# Altium project Motor Controller V2.PrjPcb
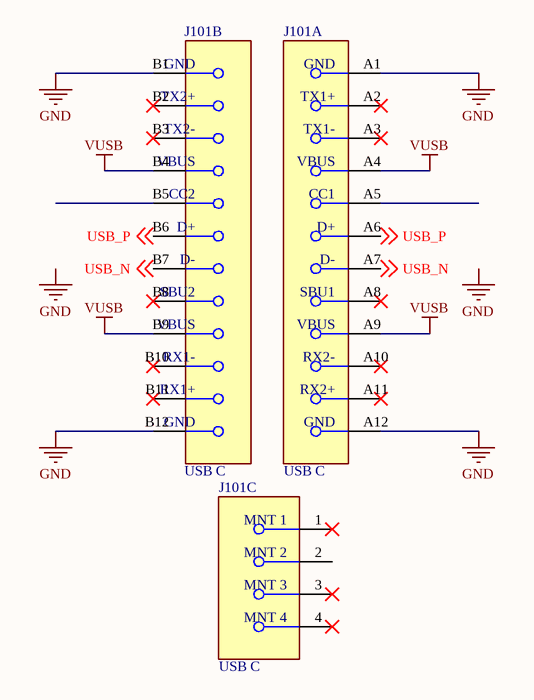
[diagram p0: Ports.SchDoc]
4 sheets, 44 parts. Net scope: global (net labels, ports and power ports of the same name join across sheets).
Board file: Main.PcbDoc
Sheets:
  Ports.SchDoc
  RP2040.SchDoc
  DRV8316.SchDoc
  AS5048A.SchDoc

## Sheet Ports.SchDoc
size A; SheetNumber: 1; SheetTotal: 3

### Parts
J101  USB C  [FP-1054500101-MFG]  (parts A,B,C of 3)

### Nets
GND: J101.A1(GND) J101.A12(GND) J101.B1(GND) J101.B12(GND)
VUSB: J101.A4(VBUS) J101.A9(VBUS) J101.B4(VBUS) J101.B9(VBUS)
USB_N: J101.A7(D-) J101.B7(D-) ; off-sheet USB_N
USB_P: J101.A6(D+) J101.B6(D+) ; off-sheet USB_P

Not connected (* = marked no-connect by the designer): J101 1(MNT_1)* 2(MNT_2) 3(MNT_3)* 4(MNT_4)* A2(TX1+)* A3(TX1-)* A5(CC1) A8(SBU1)* A10(RX2-)* A11(RX2+)* B2(TX2+)* B3(TX2-)* B5(CC2) B8(SBU2)* B10(RX1-)* B11(RX1+)*

### Notes on the sheet
- Labels drawn without touching a wire or pin: GND

### Library data of the parts
J101 = 1054500101: CONN RCP USB3.1 TYPEC 24P SMD RA; Manufacturer: Molex; Number Of Contacts: 24; Voltage Rating: 30V; Shielding: true; Is Female: yes; Current Rating: 0.25/1.25/5A; Pitch: 0.5mm; Conn Orientation: Right Angle; Package: 0; Height: 3.44mm; Footprint Url: https://www.molex.com/pdm_docs/sd/1054500101_sd.pdf; Device Class L1: Connectors; Category: Conn; Device Class L2: USB Connectors; Digikey Description: CONN RCP USB3.1 TYPEC 24P SMD RA; Contact Material: Gold,Nickel; Mouser Description: USB Shielded I/O Receptacle; Type C; Right Angle; Surface Mount; Gold over Nickel; ComponentLink2Description: Datasheet; Lead Free: Yes; Automotive: No; Temperature Range High: +85°C; RoHS: TRUE; Octopart: https://octopart.com/105450-0101-molex-68082325; ComponentLink2URL: https://www.molex.com/webdocs/datasheets/pdf/en-us/1054500101_IO_CONNECTORS.pdf; Temperature: -30°C to +85°C; Usb Standard: USB 3.1; Temperature Range Low: -30°C; Device Class L3: unset; Manufacturer Part Number: 1054500101; Supplier 1: Digi-Key; Supplier Part Number 1: WM12856CT-ND

## Sheet RP2040.SchDoc
size A3; SheetNumber: 2; SheetTotal: 4
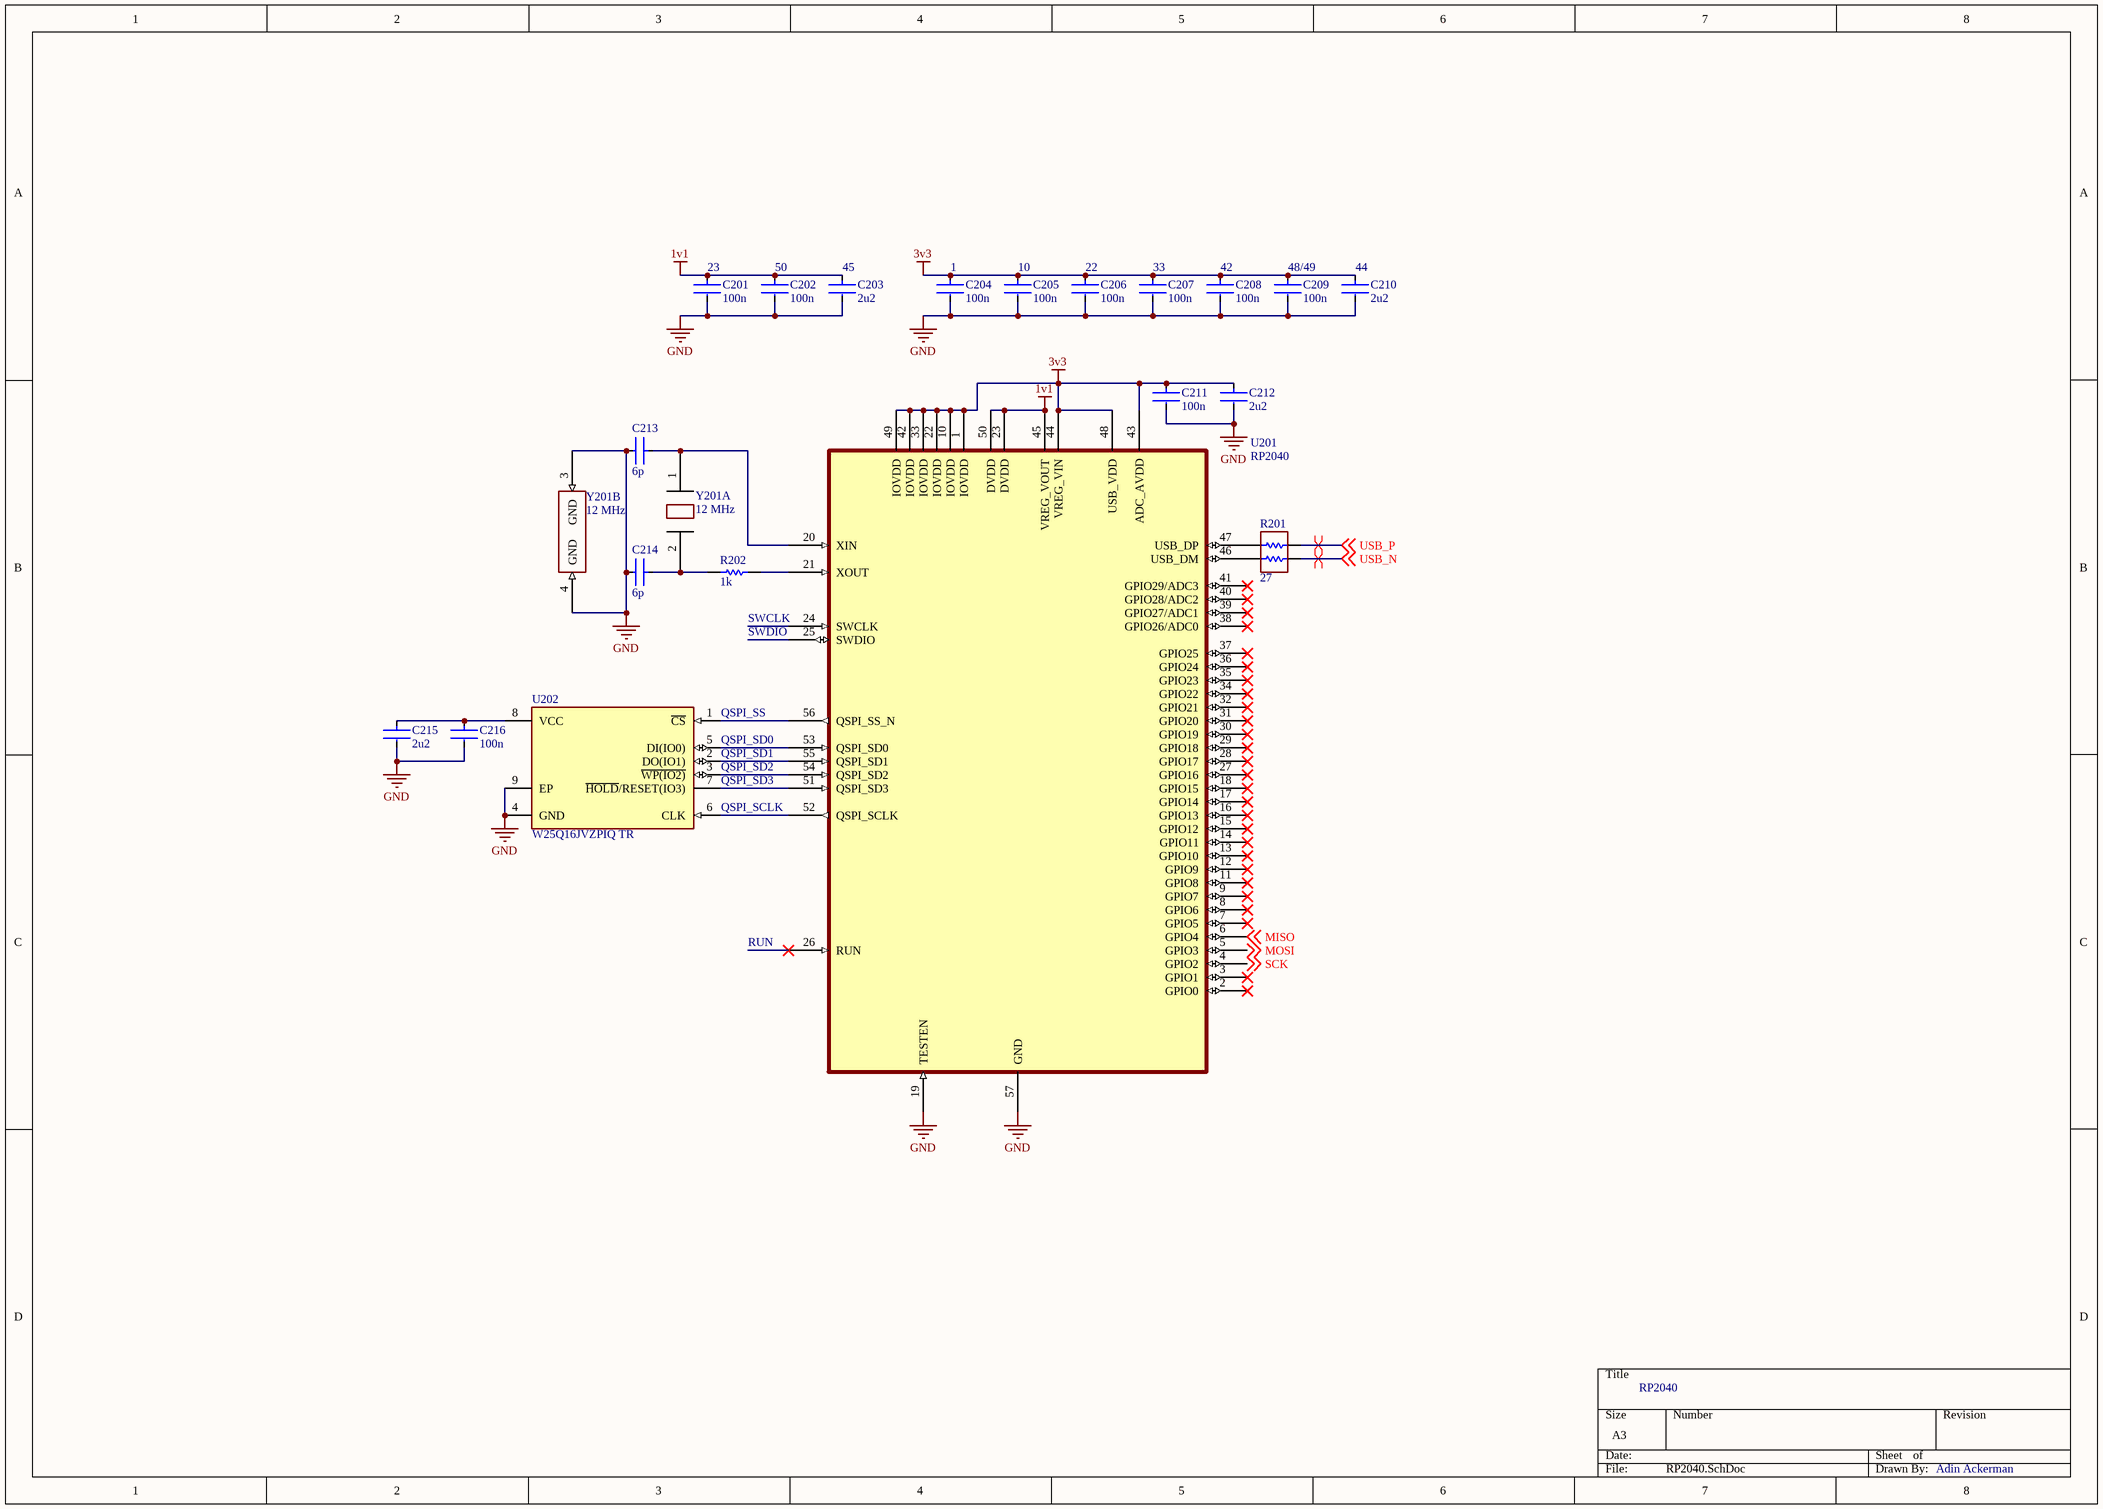
[diagram p1: RP2040.SchDoc]

### Parts
C201  100n  [FP-GCM155-0_05-MFG]
C202  100n  [FP-GCM155-0_05-MFG]
C203  2u2  [CAPC1608X10N]
C204  100n  [FP-GCM155-0_05-MFG]
C205  100n  [FP-GCM155-0_05-MFG]
C206  100n  [FP-GCM155-0_05-MFG]
C207  100n  [FP-GCM155-0_05-MFG]
C208  100n  [FP-GCM155-0_05-MFG]
C209  100n  [FP-GCM155-0_05-MFG]
C210  2u2  [CAPC1608X10N]
C211  100n  [FP-GCM155-0_05-MFG]
C212  2u2  [CAPC1608X10N]
C213  6p  [FP-GCQ155-0_05-MFG]
C214  6p  [FP-GCQ155-0_05-MFG]
C215  2u2  [CAPC1608X10N]
C216  100n  [FP-GCM155-0_05-MFG]
R201  27  [CAC-65P100X100-4L]
R202  1k  [RESC1005X04N]
U201  RP2040  [QFN40P700X700X90_HS-57N]
U202  W25Q16JVZPIQ TR  [WSON-8]
Y201  12 MHz  (parts A,B of 2)

### Nets
1v1: C201.1 C202.1 C203.1 U201.23(DVDD) U201.45(VREG_VOUT) U201.50(DVDD)
3v3: C204.1 C205.1 C206.1 C207.1 C208.1 C209.1 C210.1 C211.1 C212.1 U201.1(IOVDD) U201.10(IOVDD) U201.22(IOVDD) U201.33(IOVDD) U201.42(IOVDD) U201.43(ADC_AVDD) U201.44(VREG_VIN) U201.48(USB_VDD) U201.49(IOVDD)
GND: C201.2 C202.2 C203.2 C204.2 C205.2 C206.2 C207.2 C208.2 C209.2 C210.2 C211.2 C212.2 C213.2 C214.2 C215.2 C216.2 U201.19(TESTEN) U201.57(GND) U202.4(GND) U202.9(EP) Y201.3(GND) Y201.4(GND)
MISO: U201.6(GPIO4) ; off-sheet MISO
MOSI: U201.5(GPIO3) ; off-sheet MOSI
SCK: U201.4(GPIO2) ; off-sheet SCK
USB_N: R201.3 ; off-sheet USB_N
USB_P: R201.4 ; off-sheet USB_P
NetC213_1: C213.1 U201.20(XIN) Y201.1
NetC214_1: C214.1 R202.1 Y201.2
NetC215_1: C215.1 C216.1 U202.8(VCC)
NetR201_1: R201.1 U201.47(USB_DP)
NetR201_2: R201.2 U201.46(USB_DM)
NetR202_2: R202.2 U201.21(XOUT)
NetU201_51: U201.51(QSPI_SD3) U202.7(~{HOLD}/RESET(IO3))
NetU201_52: U201.52(QSPI_SCLK) U202.6(CLK)
NetU201_53: U201.53(QSPI_SD0) U202.5(DI(IO0))
NetU201_54: U201.54(QSPI_SD2) U202.3(~{WP(IO2)})
NetU201_55: U201.55(QSPI_SD1) U202.2(DO(IO1))
NetU201_56: U201.56(QSPI_SS_N) U202.1(~{CS})

Not connected (* = marked no-connect by the designer): U201 2(GPIO0)* 3(GPIO1)* 7(GPIO5)* 8(GPIO6)* 9(GPIO7)* 11(GPIO8)* 12(GPIO9)* 13(GPIO10)* 14(GPIO11)* 15(GPIO12)* 16(GPIO13)* 17(GPIO14)* 18(GPIO15)* 24(SWCLK) 25(SWDIO) 26(RUN)* 27(GPIO16)* 28(GPIO17)* 29(GPIO18)* 30(GPIO19)* 31(GPIO20)* 32(GPIO21)* 34(GPIO22)* 35(GPIO23)* 36(GPIO24)* 37(GPIO25)* 38(GPIO26/ADC0)* 39(GPIO27/ADC1)* 40(GPIO28/ADC2)* 41(GPIO29/ADC3)*

### Layout directives
differential pair: USB_N, USB_P

### Notes on the sheet
- (near C201) 23
- (near C202) 50
- (near C203) 45
- (near C204) 1
- (near C205) 10
- (near C206) 22
- (near C207) 33
- (near C208) 42
- (near C209) 48/49
- (near C210) 44
- SWCLK
- SWDIO
- (near U202) QSPI_SS
- (near U202) QSPI_SD0
- (near U202) QSPI_SD1
- (near U202) QSPI_SD2
- (near U202) QSPI_SD3
- (near U202) QSPI_SCLK
- RUN
- RP2040
- Adin Ackerman

### Library data of the parts
C201 C202 C204-C209 C211 C216 = GCM155R71H104KE02J: Ceramic Capacitor for Automotive 100nF ±10% 50VDC X7R 0402 Paper T/R; Voltage Rating (DC): 50V; Case Code (Metric): 1005; Dielectric: X7R; Capacitance: 100nF; Packaging: Tape and Reel; Min Operating Temperature: -55°C; Length: 0.039inch; Thickness: 0.022inch; Height: 0.5mm; Mount: Surface Mount; Termination: SMD/SMT; Voltage Rating: 50V; Package Quantity: 50000; Width: 0.02inch; Case/Package: 0402; Case Code (Imperial): 0402; Ratings: AEC-Q200; Max Operating Temperature: 125°C; Tolerance: 10%; Weight: 0.000212oz; Supplier 1: Digi-Key; Supplier Part Number 1: 490-14514-1-ND
C203 C210 C212 C215 = GRT188R61H225ME13D: Multilayer Ceramic Capacitors MLCC - SMD/SMT 0603 50Vdc 2.2uF X5R 20%; Supplier 1: Future Electronics; Supplier Part Number 1: 5087209
C213 C214 = GCQ1555C1H6R0BB01D: High Q Ceramic Capacitor for Automotive 6pF ±0.1pF 50VDC C0G 0402 Paper T/R; Voltage Rating: 50V; Max Operating Temperature: 125°C; Capacitance: 6pF; Case Code (Imperial): 0402; Min Operating Temperature: -55°C; Case/Package: 0402; Mount: Surface Mount; Case Code (Metric): 1005; Ratings: AEC-Q200; Packaging: Tape and Reel; Supplier 1: Digi-Key; Supplier Part Number 1: 490-17493-1-ND
R201 = EXB-24V270JX: Supplier 1: Digi-Key; Supplier Part Number 1: Y5270CT-ND
R202 = ERJ-2GEJ102X: Manufacturer: Panasonic; Part Number: ERJ-2GEJ102X; Supplier 1: Newark; Supplier Part Number 1: 65T8247
U202 = W25Q16JVZPIQ TR: IC FLASH 16M SPI 133MHZ 8WSON; Memory Type: Non-Volatile; Memory Size: 16Mb; Max Operating Temperature: 85°C; Min Operating Temperature: -40°C; Frequency: 133MHz; Mount: Surface Mount; Packaging: Tape and Reel; Supplier 1: Digi-Key; Supplier Part Number 1: W25Q16JVZPIQCT-ND
Y201 = ABM10-166-12.000MHZ-T3: Supplier 1: Newark; Supplier Part Number 1: 51AC8104
U201 = RP2040: Supplier 1: Newark; Supplier Part Number 1: 49AJ8739

## Sheet DRV8316.SchDoc
size A4; SheetNumber: 3; SheetTotal: 4
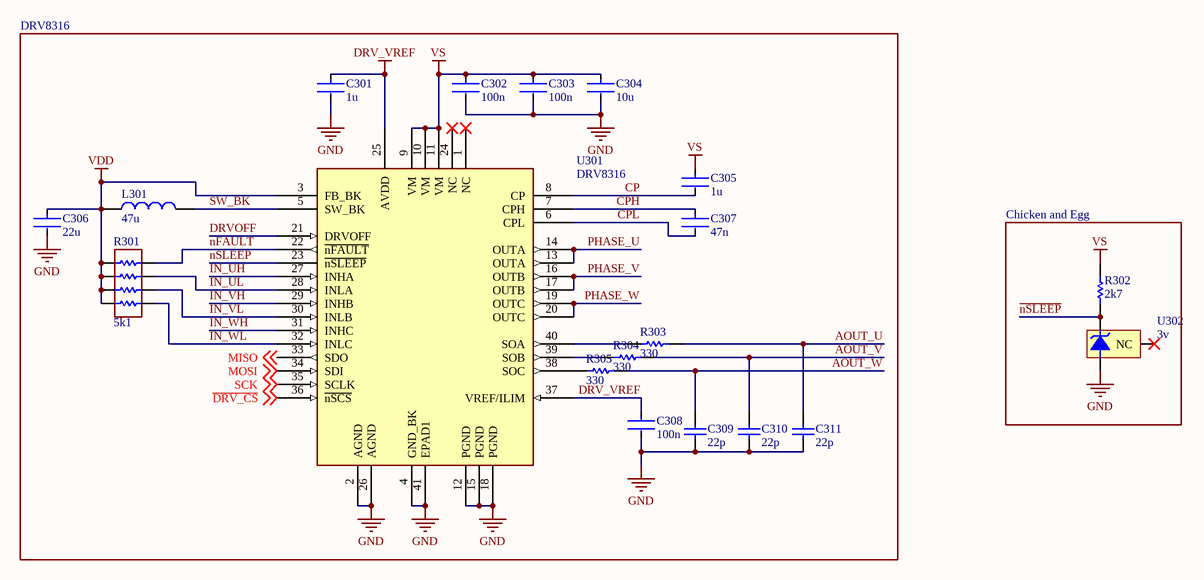
[diagram p2: DRV8316.SchDoc]

### Parts
C301  1u  [FP-GRM155-0_1-MFG]
C302  100n  [FP-GCM155-0_05-MFG]
C303  100n  [FP-GCM155-0_05-MFG]
C304  10u  [FP-GRT31C-0_2-IPC_C]
C305  1u  [FP-GRM155-0_1-MFG]
C306  22u  [FP-GRM188-0_2-IPC_C]
C307  47n  [FP-GRM155-0_05-MFG]
C308  100n  [FP-GCM155-0_05-MFG]
C309  22p  [CAPC1005X55X25LL05T10]
C310  22p  [CAPC1005X55X25LL05T10]
C311  22p  [CAPC1005X55X25LL05T10]
L301  47u  [INDC3225X25N]
R301  5k1  [CAC-50P200X100-8L]
R302  2k7  [RESC1005X04N]
R303  330  [RESC1005X04N]
R304  330  [RESC1005X04N]
R305  330  [RESC1005X04N]
U301  DRV8316  [QFN50P500X700X100_HS-41L]
U302  3v  [SOT95P237X112-3L]

### Blocks framed on the sheet
DRV8316: C301-C311 L301 R301 R303-R305 U301
Chicken and Egg: R302 U302

### Nets
DRV_VREF: C301.1 C308.1 U301.25(AVDD) U301.37(VREF/ILIM)
GND: C301.2 C302.2 C303.2 C304.2 C306.2 C308.2 C309.1 C310.1 C311.1 U301.2(AGND) U301.4(GND_BK) U301.12(PGND) U301.15(PGND) U301.18(PGND) U301.26(AGND) U301.41(EPAD1) U302.2(-V)
VDD: C306.1 L301.1 R301.1 R301.2 R301.3 R301.4 U301.3(FB_BK)
VS: C302.1 C303.1 C304.1 C305.1 R302.2 U301.9(VM) U301.10(VM) U301.11(VM)
~{DRV_CS}: U301.36(~{nSCS}) ; off-sheet ~{DRV_CS}
~{nFAULT}: R301.8 U301.22(~{nFAULT})
~{nSLEEP}: R302.1 U301.23(~{nSLEEP}) U302.1(+V)
AOUT_U: C311.2 R303.2
AOUT_V: C310.2 R304.2
AOUT_W: C309.2 R305.2
CP: C305.2 U301.8(CP)
CPH: C307.1 U301.7(CPH)
CPL: C307.2 U301.6(CPL)
DRVOFF: U301.21(DRVOFF)
IN_UH: U301.27(INHA)
IN_UL: R301.7 U301.28(INLA)
IN_VH: U301.29(INHB)
IN_VL: R301.6 U301.30(INLB)
IN_WH: U301.31(INHC)
IN_WL: R301.5 U301.32(INLC)
MISO: U301.33(SDO) ; off-sheet MISO
MOSI: U301.34(SDI) ; off-sheet MOSI
PHASE_U: U301.13(OUTA) U301.14(OUTA)
PHASE_V: U301.16(OUTB) U301.17(OUTB)
PHASE_W: U301.19(OUTC) U301.20(OUTC)
SCK: U301.35(SCLK) ; off-sheet SCK
SW_BK: L301.2 U301.5(SW_BK)
NetR303_1: R303.1 U301.40(SOA)
NetR304_1: R304.1 U301.39(SOB)
NetR305_1: R305.1 U301.38(SOC)

Not connected (* = marked no-connect by the designer): U301 1(NC)* 24(NC)*; U302 3(NC)*

### Library data of the parts
C301 C305 = GRM155R61H105ME05D: Chip Multilayer Ceramic Capacitors for General Purpose, 0402, 1.0uF, X5R, 15%, 20%, 50V; Supplier 1: Digi-Key; Supplier Part Number 1: 490-GRM155R61H105ME05DTR-ND
C302 C303 C308 = GCM155R71H104KE02J: as C201 on sheet RP2040; Case Code (Metric): 1005; Dielectric: X7R; Capacitance: 100nF; Packaging: Tape and Reel; Min Operating Temperature: -55°C; Length: 0.039inch; Thickness: 0.022inch; Height: 0.5mm; Mount: Surface Mount; Termination: SMD/SMT; Voltage Rating: 50V; Package Quantity: 50000; Width: 0.02inch; Case/Package: 0402; Case Code (Imperial): 0402; Ratings: AEC-Q200; Max Operating Temperature: 125°C; Tolerance: 10%; Weight: 0.000212oz; Supplier 1: Digi-Key; Supplier Part Number 1: 490-14514-1-ND
C304 = GRT31CR61H106ME01L: CAP CER 10UF 50V X5R 1206; Tolerance: 20%; Length: 0.126inch; Mount: Surface Mount; Packaging: Tape and Reel; Capacitance: 10uF; Case/Package: 1206; Case Code (Imperial): 1206; Max Operating Temperature: 85°C; Voltage Rating: 50V; Ratings: AEC-Q200; Min Operating Temperature: -55°C; Thickness: 0.071inch; Width: 0.063inch; Case Code (Metric): 3216; Supplier 1: Digi-Key; Supplier Part Number 1: 490-12457-1-ND
C306 = GRM188R60J226MEA0J: Chip Multilayer Ceramic Capacitors for General Purpose, 0603, 22uF, X5R, 15%, 20%, 6.3V; Capacitance: 22uF; Case Code (Metric): 1608; Thickness: 0.039inch; Dielectric: X5R; Voltage Rating: 6.3V; Termination: SMD/SMT; Voltage Rating (DC): 6.3V; Width: 0.031inch; Weight: 0.000222oz; Tolerance: 20%; Case/Package: 0603; Lead Free: Lead Free; Package Quantity: 10000; Case Code (Imperial): 0603; Length: 0.063inch; Packaging: Tape and Reel; Max Operating Temperature: 85°C; Min Operating Temperature: -55°C; Mount: Surface Mount; Supplier 1: Future Electronics; Supplier Part Number 1: 2075839
C307 = GRM155R71H473KE14D: Chip Multilayer Ceramic Capacitors for General Purpose, 0402, 47000pF, X7R, 15%, 10%, 50V; Capacitance: 47nF; Tolerance: 10%; Max Operating Temperature: 125°C; Termination: SMD/SMT; Width: 0.02inch; Package Quantity: 10000; Resistor Type: Ceramic; Packaging: Tape and Reel; Height: 0.5mm; Voltage Rating (DC): 50V; Length: 0.039inch; Dielectric: X7R; Case Code (Imperial): 0402; Voltage Rating: 50V; Mount: Surface Mount; Min Operating Temperature: -55°C; Case Code (Metric): 1005; Weight: 0.000212oz; Case/Package: 0402; Thickness: 0.022inch; Supplier 1: Digi-Key; Supplier Part Number 1: 490-10702-1-ND
C309-C311 = GRM1555C1H220GA01D: Manufacturer: Murata; Part Number: GRM1555C1H220GA01D; Supplier 1: Digi-Key; Supplier Part Number 1: 490-6219-1-ND
L301 = L1210R470KDWIT: Supplier 1: Newark; Supplier Part Number 1: 50AC9370
R301 = EXB-28V512JX: Supplier 1: Digi-Key; Supplier Part Number 1: Y7512CT-ND
R302 = ERJ-2GEJ272X: Manufacturer: Panasonic; Part Number: ERJ-2GEJ331X; Supplier 1: Digi-Key; Supplier Part Number 1: P2.7KJCT-ND
R303-R305 = ERJ-2GEJ331X: Manufacturer: Panasonic; Part Number: ERJ-2GEJ331X; Supplier 1: Digi-Key; Supplier Part Number 1: P330JCT-ND
U302 = LM4040CIM3-3.0/NOPB: Precision Micropower Shunt Voltage Reference, 3-pin SOT-23, Pb-Free; Manufacturer: National Semiconductor; PackageTopMarking: RKC*XTT; CompType: Voltage Reference IC; PowerWise: N; PackageReference: MF03A; PinCount: 3; ComponentLink1Description: LM4040 Datasheet; DatasheetVersion: Apr-2005; ComponentLink3URL: http://www.national.com/packaging/folders/mf03a.html; ComponentLink2URL: http://www.national.com/pf/LM/LM4040.html; ComponentLink1URL: http://www.national.com/ds/LM/LM4040.pdf; PackageVersion: revB, Mar-2003; RoHS: Y; RevisionNote: Component URLs added; ComponentLink2Description: LM4040 Web Page; ComponentLink3Description: MF03A Package Page; PackageDescription: Molded SOT-23, .115 x .051 x .037in Body, 3 Lead, .075 in Pitch; Supplier 1: Digi-Key; Supplier Part Number 1: LM4040CIM3-3.0/NOPBCT-ND

## Sheet AS5048A.SchDoc
size A; SheetNumber: 4; SheetTotal: 4
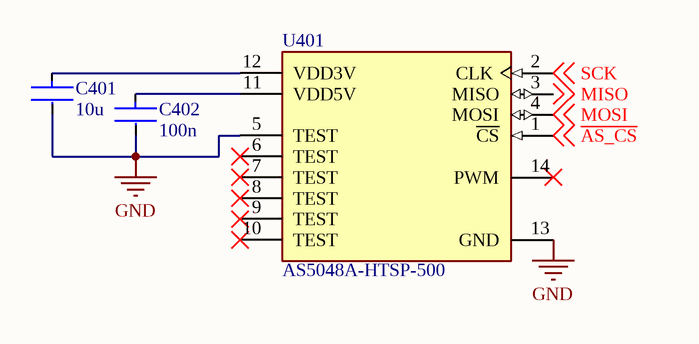
[diagram p3: AS5048A.SchDoc]

### Parts
C401  10u  [FP-GRT31C-0_2-IPC_C]
C402  100n  [FP-GCM155-0_05-MFG]
U401  AS5048A-HTSP-500  [TSOP65P640X120-14L]

### Nets
GND: C401.2 C402.2 U401.5(TEST) U401.13(GND)
~{AS_CS}: U401.1(~{CS}) ; off-sheet ~{AS_CS}
MISO: U401.3(MISO) ; off-sheet MISO
MOSI: U401.4(MOSI) ; off-sheet MOSI
SCK: U401.2(CLK) ; off-sheet SCK
NetC401_1: C401.1 U401.12(VDD3V)
NetC402_1: C402.1 U401.11(VDD5V)

Not connected (* = marked no-connect by the designer): U401 6(TEST)* 7(TEST)* 8(TEST)* 9(TEST)* 10(TEST)* 14(PWM)*

### Library data of the parts
C401 = GRT31CR61H106ME01L: as C304 on sheet DRV8316; Length: 0.126inch; Mount: Surface Mount; Packaging: Tape and Reel; Capacitance: 10uF; Case/Package: 1206; Case Code (Imperial): 1206; Max Operating Temperature: 85°C; Voltage Rating: 50V; Ratings: AEC-Q200; Min Operating Temperature: -55°C; Thickness: 0.071inch; Width: 0.063inch; Case Code (Metric): 3216; Supplier 1: Digi-Key; Supplier Part Number 1: 490-12457-1-ND
C402 = GCM155R71H104KE02J: as C201 on sheet RP2040; Case Code (Metric): 1005; Dielectric: X7R; Capacitance: 100nF; Packaging: Tape and Reel; Min Operating Temperature: -55°C; Length: 0.039inch; Thickness: 0.022inch; Height: 0.5mm; Mount: Surface Mount; Termination: SMD/SMT; Voltage Rating: 50V; Package Quantity: 50000; Width: 0.02inch; Case/Package: 0402; Case Code (Imperial): 0402; Ratings: AEC-Q200; Max Operating Temperature: 125°C; Tolerance: 10%; Weight: 0.000212oz; Supplier 1: Digi-Key; Supplier Part Number 1: 490-14514-1-ND
U401 = AS5048A-HTSP-500: SENSOR ANGLE 360DEG SMD; Operating Supply Current: 15mA; Min Supply Voltage: 4.5V; Max Supply Voltage: 5.5V; Resolution: 14b; Sensing Method: Hall Effect; Max Operating Temperature: 150°C; Case/Package: TSSOP; Termination: SMD/SMT; Lead Free: Lead Free; Mount: Surface Mount; Package Quantity: 500; Min Operating Temperature: -40°C; Packaging: Tape and Reel; Supplier 1: Mouser; Supplier Part Number 1: 985-AS5048A-HTSP-500

## Nets that join several sheets
GND: Ports (J101.A1 J101.A12 J101.B1 J101.B12), RP2040 (22 pins), DRV8316 (17 pins), AS5048A (C401.2 C402.2 U401.5 U401.13)
MISO: RP2040 (U201.6), DRV8316 (U301.33), AS5048A (U401.3)
MOSI: RP2040 (U201.5), DRV8316 (U301.34), AS5048A (U401.4)
SCK: RP2040 (U201.4), DRV8316 (U301.35), AS5048A (U401.2)
USB_N: Ports (J101.A7 J101.B7), RP2040 (R201.3)
USB_P: Ports (J101.A6 J101.B6), RP2040 (R201.4)